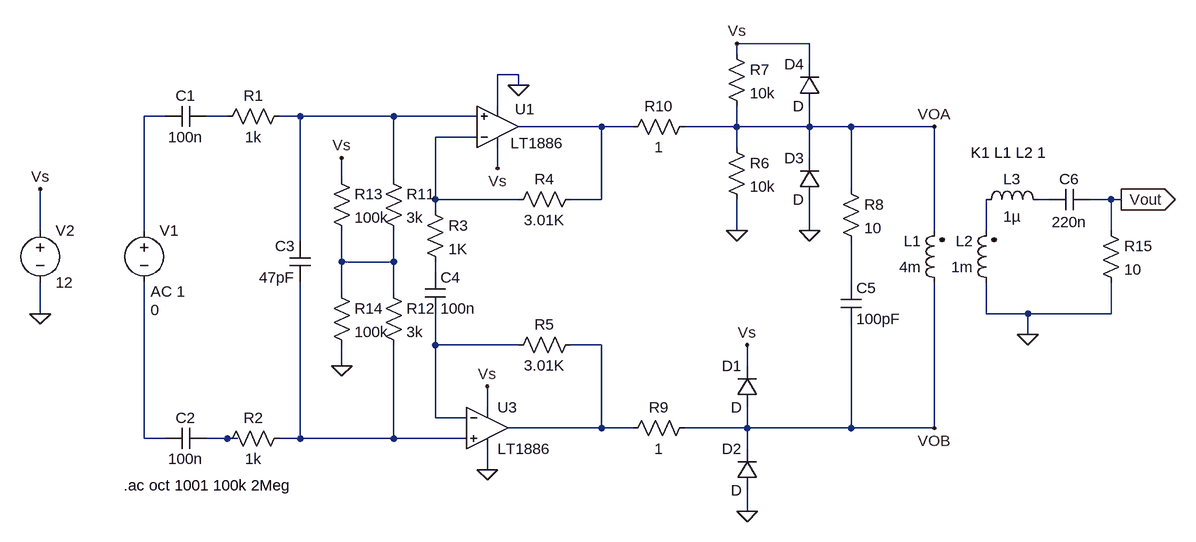
[diagram p0: schematic ISL_line_driver_TX.asc]
ISL_line_driver_TX.asc, the LTspice schematic file:
Version 4
SHEET 1 1496 680
WIRE 880 -320 768 -320
WIRE 768 -304 768 -320
WIRE 880 -288 880 -320
WIRE 432 -272 400 -272
WIRE 432 -256 432 -272
WIRE 400 -224 400 -272
WIRE -112 -208 -144 -208
WIRE -16 -208 -48 -208
WIRE 96 -208 64 -208
WIRE 240 -208 96 -208
WIRE 368 -208 240 -208
WIRE 560 -192 432 -192
WIRE 608 -192 560 -192
WIRE 768 -192 768 -224
WIRE 768 -192 688 -192
WIRE 880 -192 880 -224
WIRE 880 -192 768 -192
WIRE 944 -192 880 -192
WIRE 1072 -192 944 -192
WIRE 368 -176 304 -176
WIRE 768 -160 768 -192
WIRE 880 -144 880 -192
WIRE 400 -128 400 -160
WIRE 160 -112 160 -144
WIRE 240 -112 240 -208
WIRE 944 -96 944 -192
WIRE 304 -80 304 -176
WIRE 432 -80 304 -80
WIRE 560 -80 560 -192
WIRE 560 -80 512 -80
WIRE 1248 -80 1232 -80
WIRE 1344 -80 1312 -80
WIRE 1360 -80 1344 -80
WIRE 304 -64 304 -80
WIRE -304 -32 -304 -96
WIRE -144 -32 -144 -208
WIRE 768 -32 768 -80
WIRE 880 -32 880 -80
WIRE 1072 -32 1072 -192
WIRE 1152 -32 1152 -80
WIRE 1344 -32 1344 -80
WIRE 96 -16 96 -208
WIRE 160 16 160 -32
WIRE 240 16 240 -32
WIRE 240 16 160 16
WIRE 304 32 304 16
WIRE 944 48 944 -16
WIRE 160 64 160 16
WIRE 240 64 240 16
WIRE -304 96 -304 48
WIRE 1152 96 1152 48
WIRE 1216 96 1152 96
WIRE 1344 96 1344 48
WIRE 1344 96 1216 96
WIRE 1216 128 1216 96
WIRE 304 144 304 96
WIRE 432 144 304 144
WIRE 560 144 512 144
WIRE 160 176 160 144
WIRE 784 176 784 144
WIRE 384 240 384 208
WIRE 304 256 304 144
WIRE 352 256 304 256
WIRE 560 272 560 144
WIRE 560 272 416 272
WIRE 608 272 560 272
WIRE 784 272 784 240
WIRE 784 272 688 272
WIRE 944 272 944 112
WIRE 944 272 784 272
WIRE 1072 272 1072 48
WIRE 1072 272 944 272
WIRE -144 288 -144 48
WIRE -112 288 -144 288
WIRE -16 288 -48 288
WIRE 0 288 -16 288
WIRE 96 288 96 48
WIRE 96 288 64 288
WIRE 240 288 240 144
WIRE 240 288 96 288
WIRE 352 288 240 288
WIRE 784 304 784 272
WIRE 384 336 384 304
WIRE 784 400 784 368
FLAG 768 -320 Vs
FLAG 768 -32 0
FLAG -304 96 0
FLAG -304 -96 Vs
FLAG 784 144 Vs
FLAG 784 400 0
FLAG 880 -32 0
FLAG 400 -128 Vs
FLAG 432 -256 0
FLAG 384 208 Vs
FLAG 384 336 0
FLAG 160 176 0
FLAG 160 -144 Vs
FLAG 1216 128 0
FLAG 1360 -80 Vout
IOPIN 1360 -80 Out
FLAG 1072 -192 VOA
FLAG 1072 272 VOB
SYMBOL res 80 -224 R90
WINDOW 0 0 56 VBottom 2
WINDOW 3 32 56 VTop 2
SYMATTR InstName R1
SYMATTR Value 1k
SYMBOL res 80 272 R90
WINDOW 0 0 56 VBottom 2
WINDOW 3 32 56 VTop 2
SYMATTR InstName R2
SYMATTR Value 1k
SYMBOL cap -48 -224 R90
WINDOW 0 0 32 VBottom 2
WINDOW 3 32 32 VTop 2
SYMATTR InstName C1
SYMATTR Value 100n
SYMBOL cap -48 272 R90
WINDOW 0 0 32 VBottom 2
WINDOW 3 32 32 VTop 2
SYMATTR InstName C2
SYMATTR Value 100n
SYMBOL cap 112 48 R180
WINDOW 0 24 56 Left 2
WINDOW 3 24 8 Left 2
SYMATTR InstName C3
SYMATTR Value 47pF
SYMBOL voltage -144 -48 R0
WINDOW 123 10 110 Left 2
WINDOW 39 0 0 Left 2
WINDOW 3 10 138 Left 2
SYMATTR Value2 AC 1
SYMATTR Value 0
SYMATTR InstName V1
SYMBOL Opamps\\LT1886 384 208 R0
SYMATTR InstName U3
SYMBOL opamps\\LT1886 400 -128 M180
WINDOW 0 27 91 Left 2
WINDOW 3 20 39 Left 2
SYMATTR InstName U1
SYMBOL res 528 -96 R90
WINDOW 0 0 56 VBottom 2
WINDOW 3 32 56 VTop 2
SYMATTR InstName R4
SYMATTR Value 3.01K
SYMATTR SpiceLine tol=1 pwr=0.1
SYMBOL res 528 128 R90
WINDOW 0 0 56 VBottom 2
WINDOW 3 32 56 VTop 2
SYMATTR InstName R5
SYMATTR Value 3.01K
SYMATTR SpiceLine tol=1 pwr=0.1
SYMBOL cap 288 32 R0
SYMATTR InstName C4
SYMATTR Value 100n
SYMBOL res 752 -176 R0
SYMATTR InstName R6
SYMATTR Value 10k
SYMBOL res 752 -320 R0
SYMATTR InstName R7
SYMATTR Value 10k
SYMBOL res 928 -112 R0
SYMATTR InstName R8
SYMATTR Value 10
SYMBOL cap 928 48 R0
SYMATTR InstName C5
SYMATTR Value 100pF
SYMBOL voltage -304 -48 R0
WINDOW 123 0 0 Left 2
WINDOW 39 0 0 Left 2
SYMATTR InstName V2
SYMATTR Value 12
SYMBOL diode 800 240 R180
WINDOW 0 24 64 Left 2
WINDOW 3 24 0 Left 2
SYMATTR InstName D1
SYMBOL diode 800 368 R180
WINDOW 0 24 64 Left 2
WINDOW 3 24 0 Left 2
SYMATTR InstName D2
SYMBOL res 704 256 R90
WINDOW 0 0 56 VBottom 2
WINDOW 3 32 56 VTop 2
SYMATTR InstName R9
SYMATTR Value 1
SYMBOL res 704 -208 R90
WINDOW 0 0 56 VBottom 2
WINDOW 3 32 56 VTop 2
SYMATTR InstName R10
SYMATTR Value 1
SYMBOL diode 896 -80 R180
WINDOW 0 24 64 Left 2
WINDOW 3 24 0 Left 2
SYMATTR InstName D3
SYMBOL diode 896 -224 R180
WINDOW 0 24 64 Left 2
WINDOW 3 24 0 Left 2
SYMATTR InstName D4
SYMBOL res 224 -128 R0
SYMATTR InstName R11
SYMATTR Value 3k
SYMBOL res 224 48 R0
SYMATTR InstName R12
SYMATTR Value 3k
SYMBOL res 144 -128 R0
SYMATTR InstName R13
SYMATTR Value 100k
SYMBOL res 144 48 R0
SYMATTR InstName R14
SYMATTR Value 100k
SYMBOL res 288 -80 R0
SYMATTR InstName R3
SYMATTR Value 1K
SYMATTR SpiceLine tol=1 pwr=0.1
SYMBOL ind2 1088 64 R180
WINDOW 0 36 80 Left 2
WINDOW 3 36 40 Left 2
SYMATTR InstName L1
SYMATTR Value 4m
SYMBOL ind2 1168 64 R180
WINDOW 0 36 80 Left 2
WINDOW 3 36 40 Left 2
SYMATTR InstName L2
SYMATTR Value 1m
SYMBOL res 1328 -48 R0
SYMATTR InstName R15
SYMATTR Value 10
SYMBOL cap 1312 -96 R90
WINDOW 0 0 32 VBottom 2
WINDOW 3 35 32 VTop 2
SYMATTR InstName C6
SYMATTR Value 220n
SYMBOL ind 1136 -64 R270
WINDOW 0 32 56 VTop 2
WINDOW 3 5 56 VBottom 2
SYMATTR InstName L3
SYMATTR Value 1µ
TEXT -176 360 Left 2 !.ac oct 1001 100k 2Meg
TEXT 1128 -152 Left 2 !K1 L1 L2 1

The netlist it stands for:
* ISL_line_driver_TX.asc
R1 N003 N002 1k
R2 N015 N014 1k
C1 N002 N001 100n
C2 N014 N013 100n
C3 N015 N003 47pF
V1 N001 N013 0 AC 1
XU3 N015 N011 Vs 0 N012 LT1886  ; pins In+ In- V+ V- OUT
XU1 N003 N005 Vs 0 N004 LT1886  ; pins In+ In- V+ V- OUT
R4 N004 N005 3.01K tol=1 pwr=0.1
R5 N012 N011 3.01K tol=1 pwr=0.1
C4 N009 N011 100n
R6 VOA 0 10k
R7 Vs VOA 10k
R8 VOA N010 10
C5 N010 VOB 100pF
V2 Vs 0 12
D1 VOB Vs D
D2 0 VOB D
R9 VOB N012 1
R10 VOA N004 1
D3 0 VOA D
D4 VOA Vs D
R11 N003 N008 3k
R12 N008 N015 3k
R13 Vs N008 100k
R14 N008 0 100k
R3 N005 N009 1K tol=1 pwr=0.1
L1 VOB VOA 4m
L2 0 N007 1m
R15 Vout 0 10
C6 Vout N006 220n
L3 N007 N006 1µ
.model D D
.lib standard.dio
.ac oct 1001 100k 2Meg
K1 L1 L2 1
.backanno
.end